# EasyEDA schematic SCH_IOT2025_2025-10-15.json
TITLE: Inteligentna Kostka; REV: 1.0; Date: 2025-10-14; Sheet: 1/1; Drawn By: pkurek; Company: Grupa 3
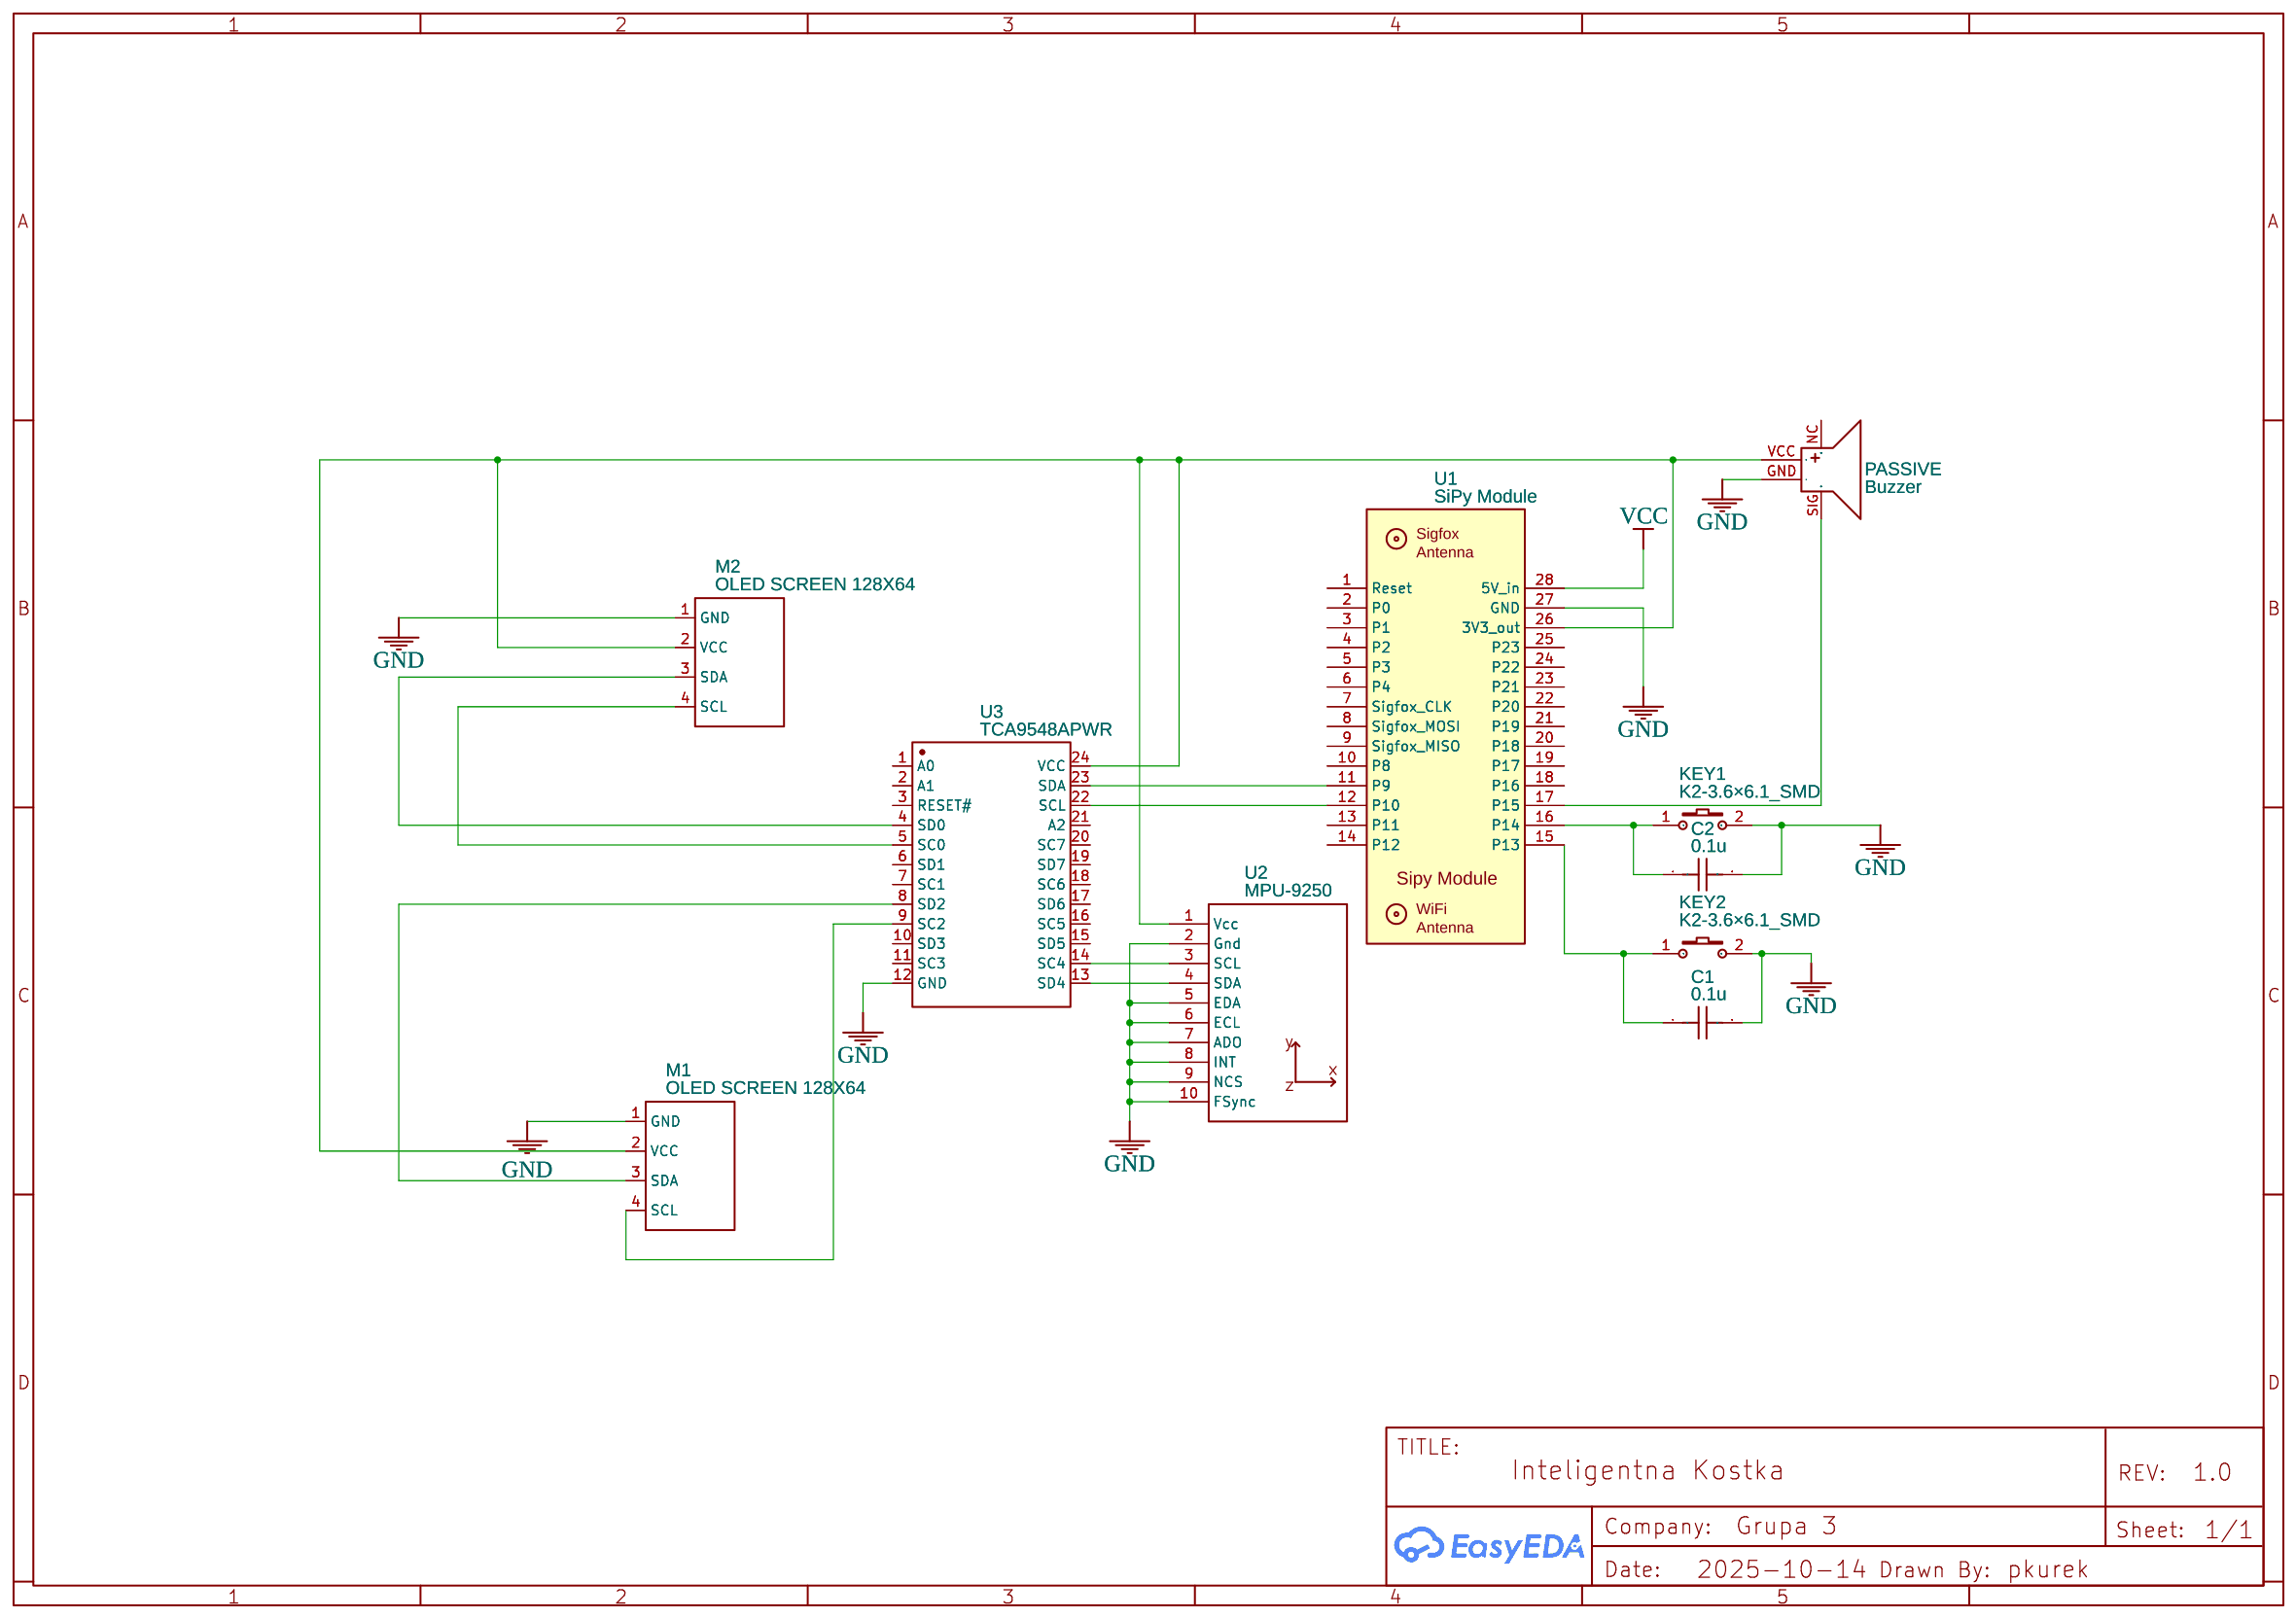
[diagram p0: schematic sheet]

## Parts
C1  0.1u  [C0603]
C2  0.1u  [C0603]
KEY1  K2-3.6×6.1_SMD  [KEY-SMD_2P-L6.2-W3.6-LS8.0]
KEY2  K2-3.6×6.1_SMD  [KEY-SMD_2P-L6.2-W3.6-LS8.0]
M1  OLED SCREEN 128X64  [I2C LCD1602 I2C]
M2  OLED SCREEN 128X64  [I2C LCD1602 I2C]
PASSIVE  Buzzer  [BUZ-SMD_4P-L8.5-W8.5-TL]
U1  SiPy Module  [SIPY MODULE]
U2  MPU-9250  [MPU-9250]
U3  TCA9548APWR  [TSSOP-24_L7.8-W4.4-P0.65-LS6.4-BL]

## Library data of the parts
C1 C2 = C_0603_US: Contributor: LCEDA_Lib
KEY1 KEY2 = K2-3.6×6.1_SMD: Supplier Part: C118141; Supplier: LCSC; Manufacturer Part: K2-1107ST-A4SW-06; Contributor: LCEDA_Lib; 制造商: 韩国韩荣
M1 M2 = LCD 16X2 I2C: Contributor: tshepangmokhele2383
PASSIVE = MLT-8530_C9900000449: Contributor: LCSC; Supplier: LCSC; Supplier Part: C9900000449; Manufacturer: null; Manufacturer Part: MLT-8530; JLCPCB Part Class: Extended Part
U1 = SiPy Module: Manufacturer Part: https://pycom.io/product/sipy/; Supplier: Pycom; Contributor: imalipusram
U2 = MPU-9250: Contributor: evels
U3 = TCA9548APWR: Supplier: LCSC; Manufacturer: TI(德州仪器); Supplier Part: C130026; JLCPCB Part Class: Extended Part

## Nets
GND: C1.2 C2.2 KEY1.2 KEY2.2 M1.1(GND) M2.1(GND) PASSIVE.GND(-) U1.27(GND) U2.2(Gnd) U2.5(EDA) U2.6(ECL) U2.7(ADO) U2.8(INT) U2.9(NCS) U2.10(FSync) U3.12(GND)
VCC: U1.28(5V in)
Net-(C1-1): C1.1 KEY2.1 U1.15(P13)
Net-(C2-1): C2.1 KEY1.1 U1.16(P14)
Net-(M1-2): M1.2(VCC) M2.2(VCC) PASSIVE.VCC(+) U1.26(3V3 out) U2.1(Vcc) U3.24(VCC)
Net-(M1-3): M1.3(SDA) U3.8(SD2)
Net-(M1-4): M1.4(SCL) U3.9(SC2)
Net-(M2-3): M2.3(SDA) U3.4(SD0)
Net-(M2-4): M2.4(SCL) U3.5(SC0)
Net-(PASSIVE-SIG): PASSIVE.SIG(NC) U1.17(P15)
Net-(U1-11): U1.11(P9) U3.23(SDA)
Net-(U1-12): U1.12(P10) U3.22(SCL)
Net-(U2-3): U2.3(SCL) U3.14(SC4)
Net-(U2-4): U2.4(SDA) U3.13(SD4)

Not connected (* = marked no-connect by the designer): PASSIVE NC; U1 1(Reset) 2(P0) 3(P1) 4(P2) 5(P3) 6(P4) 7(Sigfox_CLK) 8(Sigfox_MOSI) 9(Sigfox_MISO) 10(P8) 13(P11) 14(P12) 18(P16) 19(P17) 20(P18) 21(P19) 22(P20) 23(P21) 24(P22) 25(P23); U3 1(A0) 2(A1) 3(RESET#) 6(SD1) 7(SC1) 10(SD3) 11(SC3) 15(SD5) 16(SC5) 17(SD6) 18(SC6) 19(SD7) 20(SC7) 21(A2)
